# Altium schematic sheet SMD VR_2023-05-26.schdoc
size 245 x 109 mm
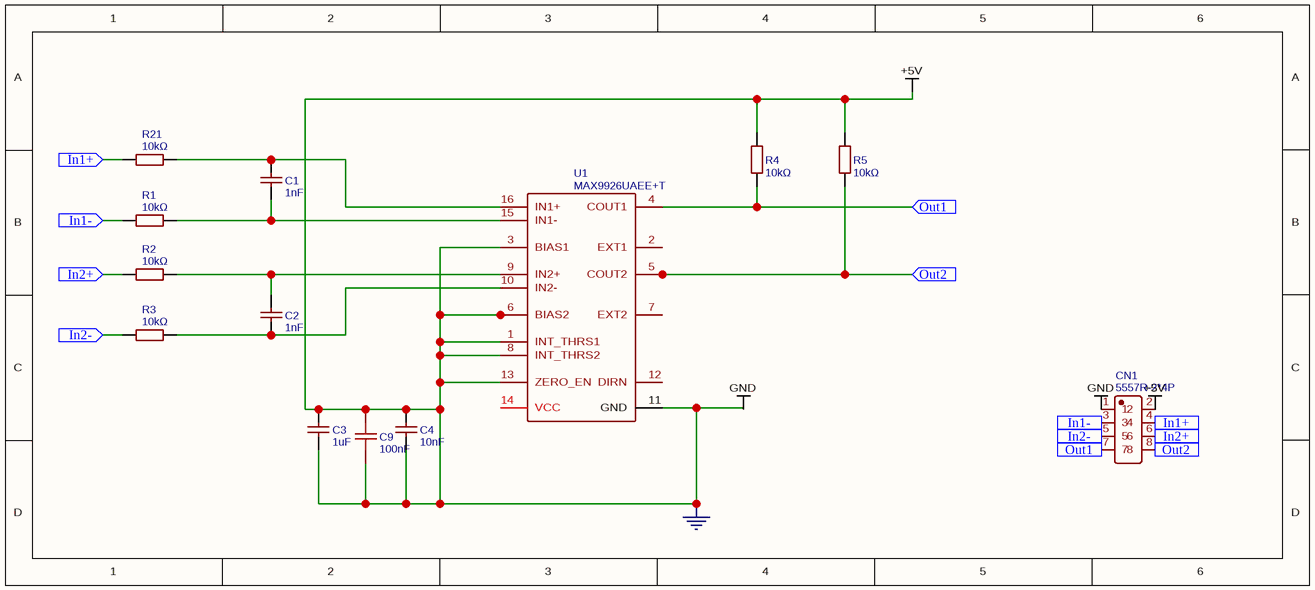
[diagram p0: SMD VR_2023-05-26.schdoc]

## Parts
C1  1nF  [C0603]
C2  1nF  [C0603]
C3  1uF  [C0603]
C4  10nF  [C0402]
C9  100nF  [C0603]
CN1  5557R-2*4P  [CONN-TH_8P-P4.20_5557R-2X4P]
R1  10kΩ  [R0402]
R2  10kΩ  [R0402]
R3  10kΩ  [R0402]
R4  10kΩ  [R0402]
R5  10kΩ  [R0402]
R21  10kΩ  [R0402]
U1  MAX9926UAEE+T  [QSOP-16_150MIL]

## Ports
In1+ (in), In1- (in), In2+ (in), In2- (in), Out1 (in), Out2 (in)

## Nets
+5V: C3.1 C3.2 C4.1 C4.2 C9.1 C9.2 CN1.1 CN1.2 R4.1 R5.1 U1.1(INT_THRS1) U1.3(BIAS1) U1.6(BIAS2) U1.8(INT_THRS2) U1.11(GND) U1.13(ZERO_EN)  [also labelled GND]
In1+: CN1.4 R21.2 ; port In1+
In1-: CN1.3 R1.2 ; port In1-
In2+: CN1.6 R2.2 ; port In2+
In2-: CN1.5 R3.2 ; port In2-
Out1: CN1.7 R4.2 U1.4(COUT1) ; port Out1
Out2: CN1.8 R5.2 U1.5(COUT2) ; port Out2
NetC1_1: C1.1 R1.1 U1.15(IN1-)
NetC1_2: C1.2 R21.1 U1.16(IN1+)
NetC2_1: C2.1 R3.1 U1.10(IN2-)
NetC2_2: C2.2 R2.1 U1.9(IN2+)

Not connected (* = marked no-connect by the designer): U1 2(EXT1) 7(EXT2) 12(DIRN) 14(VCC)

## Library data of the parts
C1 C2 = 1nF: BOM_Manufacturer Part: CL10B102KB8NNNC; BOM_Manufacturer: SAMSUNG; nameAlias: Capacitance; BOM_Supplier: LCSC; BOM_Supplier Part: C1588; BOM_JLCPCB Part Class: Basic Part; spicePre: C; spiceSymbolName: CL10B102KB8NNNC
C3 = 1uF: BOM_Manufacturer Part: CL10A105KB8NNNC; BOM_Manufacturer: SAMSUNG; nameAlias: Capacitance; BOM_Supplier: LCSC; BOM_Supplier Part: C15849; BOM_JLCPCB Part Class: Basic Part; spicePre: C; spiceSymbolName: CL10A105KB8NNNC
C4 = 10nF: BOM_Manufacturer Part: CL05B103KB5NNNC; BOM_Manufacturer: SAMSUNG; nameAlias: Capacitance; BOM_Supplier: LCSC; BOM_Supplier Part: C15195; BOM_JLCPCB Part Class: Basic Part; spicePre: C; spiceSymbolName: CL05B103KB5NNNC
C9 = 100nF: BOM_Manufacturer: YAGEO; BOM_Manufacturer Part: CC0603KRX7R9BB104; nameAlias: Capacitance; BOM_Supplier: LCSC; BOM_Supplier Part: C14663; BOM_JLCPCB Part Class: Basic Part; spicePre: C; spiceSymbolName: CC0603KRX7R9BB104
CN1 = 5557R-2*4P: BOM_Manufacturer: Ckmtw(Shenzhen Cankemeng); Contributor: LCSC; BOM_Supplier: LCSC; BOM_Supplier Part: C477838; BOM_Manufacturer Part: 5557R-2*4P; BOM_JLCPCB Part Class: Extended Part; spicePre: C; spiceSymbolName: 5557R-2*4P
R1-R5 R21 = 10kΩ: BOM_Manufacturer: UniOhm; BOM_Manufacturer Part: 0402WGF1002TCE; nameAlias: Resistance; Resistance (Ohms): 10K; BOM_Supplier: LCSC; BOM_Supplier Part: C25744; BOM_JLCPCB Part Class: Basic Part; spicePre: R; spiceSymbolName: 0402WGF1002TCE
U1 = MAX9926UAEE+T: description: Dual-Channel, Variable Reluctance Sensor Interface with No Low Power Shutdown, 4.5 to 5.5 V, -40 to 125 degC, 16-Pin SOP (E16+1), Pb-Free, Tape and Reel; BOM_Manufacturer Part: ?; spicePre: U